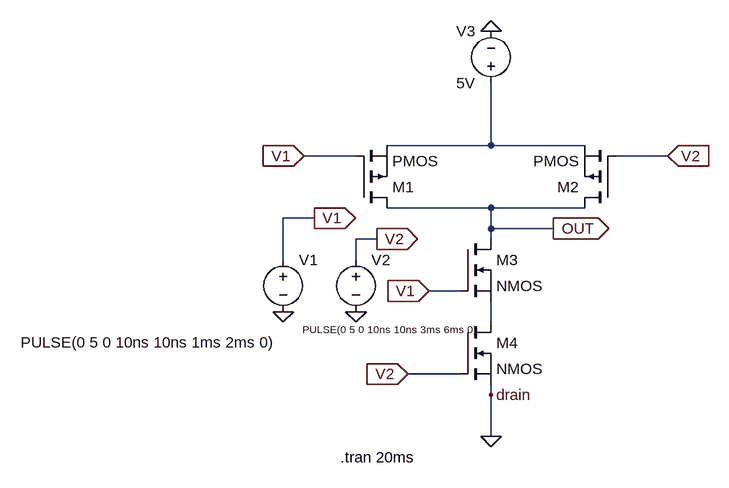
[diagram p0: schematic PorteNand.asc]
PorteNand.asc, the LTspice schematic file:
Version 4
SHEET 1 880 680
WIRE 368 64 368 -32
WIRE 368 64 208 64
WIRE 512 64 368 64
WIRE 160 80 80 80
WIRE 640 80 560 80
WIRE 368 160 208 160
WIRE 512 160 368 160
WIRE 96 176 48 176
WIRE 368 192 368 160
WIRE 464 192 368 192
WIRE 192 208 160 208
WIRE 368 208 368 192
WIRE 48 240 48 176
WIRE 160 240 160 208
WIRE 320 288 272 288
WIRE 368 336 368 304
WIRE 320 416 240 416
WIRE 368 448 368 432
WIRE 368 512 368 448
FLAG 368 -112 0
FLAG 160 320 0
FLAG 48 320 0
FLAG 368 512 0
FLAG 464 192 OUT
IOPIN 464 192 Out
FLAG 96 176 V1
IOPIN 96 176 Out
FLAG 192 208 V2
IOPIN 192 208 Out
FLAG 240 416 V2
IOPIN 240 416 In
FLAG 640 80 V2
IOPIN 640 80 In
FLAG 80 80 V1
IOPIN 80 80 In
FLAG 272 288 V1
IOPIN 272 288 In
FLAG 368 448 drain
SYMBOL voltage 48 224 R0
WINDOW 3 -404 143 Left 2
WINDOW 123 0 0 Left 0
WINDOW 39 0 0 Left 0
SYMATTR InstName V1
SYMATTR Value PULSE(0 5 0 10ns 10ns 1ms 2ms 0)
SYMBOL voltage 160 224 R0
WINDOW 3 -82 123 Left 1
WINDOW 123 0 0 Left 0
SYMATTR InstName V2
SYMATTR Value PULSE(0 5 0 10ns 10ns 3ms 6ms 0)
SYMBOL voltage 368 -16 R180
WINDOW 0 24 96 Left 2
WINDOW 3 24 16 Left 2
WINDOW 123 0 0 Left 0
WINDOW 39 0 0 Left 0
SYMATTR InstName V3
SYMATTR Value 5V
SYMBOL pmos 160 160 M180
SYMATTR InstName M1
SYMBOL pmos 560 160 R180
SYMATTR InstName M2
SYMBOL nmos 320 208 R0
SYMATTR InstName M3
SYMBOL nmos 320 336 R0
SYMATTR InstName M4
TEXT 136 544 Left 2 !.tran 20ms

The netlist it stands for:
* PorteNand.asc
V1 V1 0 PULSE(0 5 0 10ns 10ns 1ms 2ms 0)
V2 V2 0 PULSE(0 5 0 10ns 10ns 3ms 6ms 0)
V3 N001 0 5V
M1 OUT V1 N001 N001 PMOS
M2 OUT V2 N001 N001 PMOS
M3 OUT V1 N002 N002 NMOS
M4 N002 V2 0 0 NMOS
.model NMOS NMOS
.model PMOS PMOS
.lib standard.mos
.tran 20ms
.backanno
.end

* Results of the author's LTspice run, read from the files saved beside the schematic
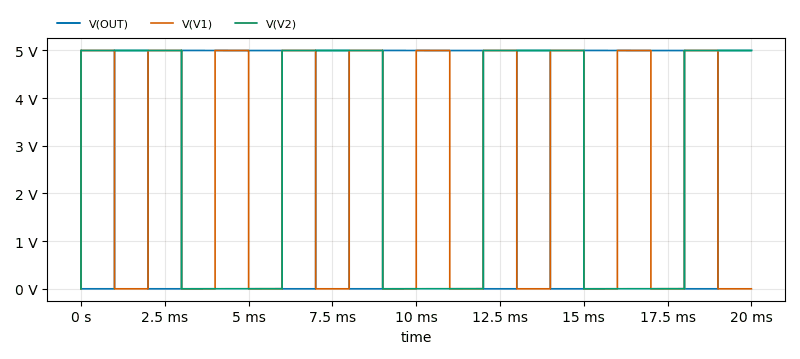
[diagram p1: Transient Analysis of PorteNand.asc, plotted from the saved traces]
* Transient Analysis, 1 run:
*   V(OUT): min 0 V, max 5.002 V, average 3.25 V, rms 4.031 V, last 5 V
*   V(V1): min 0 V, max 5 V, average 2.5 V, rms 3.536 V, last 0 V
*   V(V2): min 0 V, max 5 V, average 2.75 V, rms 3.708 V, last 5 V